# Altium schematic sheet USB.SchDoc: USB interface
size A3; DrawnBy: Mogens Groth Nicolaisen; DocumentNumber: 6; SheetNumber: 6; SheetTotal: 7
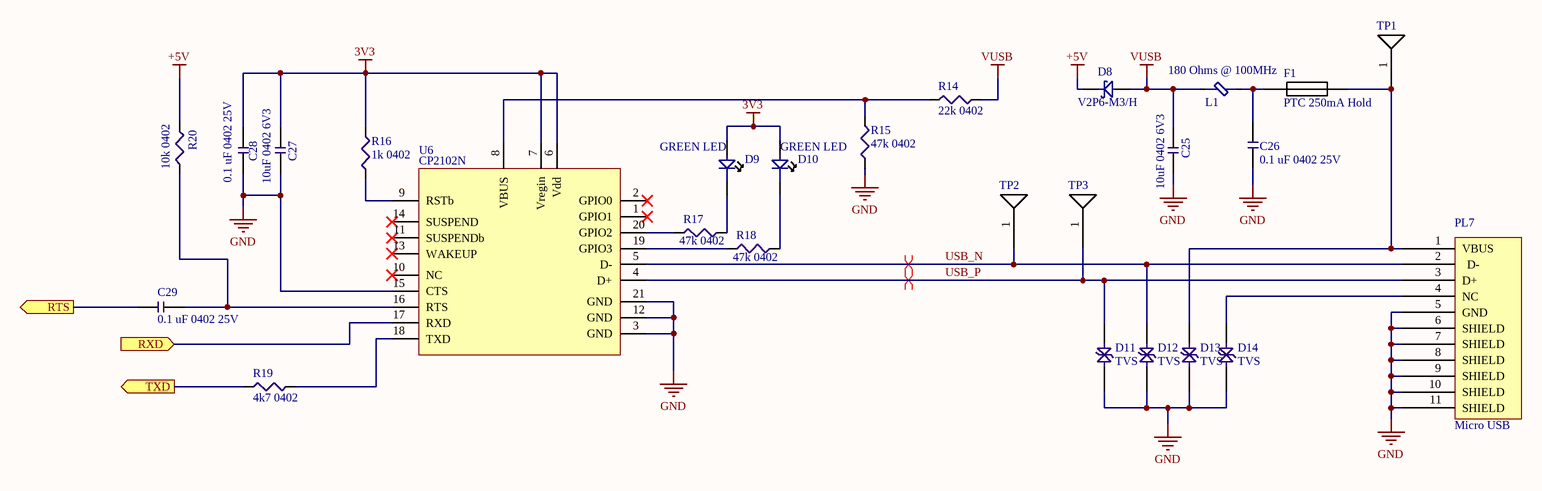
[diagram p0: USB.SchDoc]

## Parts
C25  10uF 0402 6V3  [CAP_0402]
C26  0.1 uF 0402 25V  [CAP_0402]
C27  10uF 0402 6V3  [CAP_0402]
C28  0.1 uF 0402 25V  [CAP_0402]
C29  0.1 uF 0402 25V  [CAP_0402]
D8  V2P6-M3/H  [MicroSMP]
D9  GREEN LED  [0402 LED]
D10  GREEN LED  [0402 LED]
D11  TVS  [RES_0402]
D12  TVS  [RES_0402]
D13  TVS  [RES_0402]
D14  TVS  [RES_0402]
F1  PTC 250mA Hold  [PTC Fuse 1206]
L1  180 Ohms @ 100MHz  [IND_0603]
PL7  Micro USB  [10118193-0001LF Micro USB]
R14  22k 0402  [RES_0402]
R15  47k 0402  [RES_0402]
R16  1k 0402  [RES_0402]
R17  47k 0402  [RES_0402]
R18  47k 0402  [RES_0402]
R19  4k7 0402  [RES_0402]
R20  10k 0402  [RES_0402]
TP1  TestPoint  [1x0mm]  (value not drawn)  (no BOM)
TP2  TestPoint  [1x0mm]  (value not drawn)  (no BOM)
TP3  TestPoint  [1x0mm]  (value not drawn)  (no BOM)
U6  CP2102N  [QFN50P300X300X80_HS-21N]

## Ports
RTS (out), RXD (in), TXD (out)

## Nets
3V3: C27.2 C28.2 D9.1 D10.1 R16.2 U6.6(Vdd) U6.7(Vregin)
+5V: D8.2 R20.2
GND: C25.1 C26.1 C27.1 C28.1 D11.1(Anode) D12.1(Anode) D13.1(Anode) D14.1(Anode) PL7.5(GND) PL7.6(SHIELD) PL7.7(SHIELD) PL7.8(SHIELD) PL7.9(SHIELD) PL7.10(SHIELD) PL7.11(SHIELD) R15.1 U6.3(GND) U6.12(GND) U6.15(CTS) U6.21(GND)
VUSB: C25.2 D8.1 L1.1 R14.2
RTS: C29.2 ; port RTS
RXD: U6.17(RXD) ; port RXD
TXD: R19.2 ; port TXD
USB_N: D12.2(Cathode) PL7.2(D-) TP2.1 U6.5(D-)
USB_P: D11.2(Cathode) PL7.3(D+) TP3.1 U6.4(D+)
NetC26_2: C26.2 F1.1 L1.2
NetC29_1: C29.1 R20.1 U6.16(RTS)
NetD9_2: D9.2 R17.1
NetD10_2: D10.2 R18.1
NetD13_2: D13.2(Cathode) F1.2 PL7.1(VBUS) TP1.1
NetD14_2: D14.2(Cathode) PL7.4(NC)
NetR14_1: R14.1 R15.2 U6.8(VBUS)
NetR16_1: R16.1 U6.9(RSTb)
NetR17_2: R17.2 U6.20(GPIO2)
NetR18_2: R18.2 U6.19(GPIO3)
NetR19_1: R19.1 U6.18(TXD)

Not connected (* = marked no-connect by the designer): U6 1(GPIO1)* 2(GPIO0)* 10(NC)* 11(SUSPENDb)* 13(WAKEUP)* 14(SUSPEND)*

## Layout directives
differential pair: USB_N, USB_P

## Notes on the sheet
- ON Development
- Title:
- Size:
- A3
- Drawn By:
- Date:
- Sheet
- of
- Revision:

## Library data of the parts
C25 C27 = CMP-00011-3: 10uF 20% 0402 6V3 X6S; Current Rating: -; Tolerance: 20%; Value: 10uF; Voltage: 6V3
C26 C28 C29 = CMP-00061-4: 0.1UF 25V 10% X5R 0402; Mfg. Part Number: TMK105BJ104KV-F; Tolerance: 10%; Value: 0.1 uF; Voltage: 25V
D8 = CMP-016-0002-2: DIODE SCHOTTKY 60V 2A MICROSMP
D9 D10 = CMP-008-0001-2: 0402 SMD LED; Mfg. Part Number: LTST-C281KGKT
D11-D14 = CMP-016-0004-2: TVS DIODE 12VC 8A IPP 0402; Mfg. Part Number: GG040205100N2P
F1 = CMP-017-0000-3: PTC RESET FUSE 24V 250MA 1206; Mfg. Part Number: 0ZCJ0025AF2E; Case/Package: 1206; Mount: SMD; Pins: 2; RoHS: Yes
L1 = CMP-ROOT-0005-2: FERRITE BEAD 180 OHM 0603 1LN; Mfg. Part Number: BLM18PG181SN1D; Current: 1.5A; Value: 180 Ohm; Case/Package: 0603
PL7 = CMP-003-0000-3: CONN USB MICRO B RECPT SMT R/A; Mfg. Part Number: 10118193-0001LF
R14 = CMP-001-0026-3: RES SMD 22K OHM 1% 1/16W 0402; Mfg. Part Number: RMCF0402FT22K0; Case/Package: 0402; Power: 1/16W; Tolerance: 1%; Value: 22k
R15 R17 R18 = CMP-001-0027-3: RES SMD 47K OHM 1% 1/16W 0402; Mfg. Part Number: RMCF0402FT47K0; Case/Package: 0402; Power: 1/16W; Tolerance: 1%; Value: 47k
R16 = CMP-001-0025-3: RES SMD 1K OHM 1% 1/16W 0402; Mfg. Part Number: CRG0402F1K0; Case/Package: 0402; Power: 1/16W; Tolerance: 1%; Value: 1k
R19 = CMP-001-0029-3: RES SMD 4.7K OHM 1% 1/16W 0402; Mfg. Part Number: RC1005F472CS; Tolerance: 1; Case/Package: 0402; Power: 1/16W; Value: 4k7
R20 = CMP-001-0019-3: RES SMD 10K OHM 1% 1/16W 0402; Mfg. Part Number: RMCF0402FT10K0; Case/Package: 0402; Power: 1/16 W; Tolerance: 1 %; Value: 10k
TP1-TP3 = CMP-ROOT-0006-0.0
U6 = CMP-00038-5: IC BRIDGE USB TO UART 20QFN; Mfg. Part Number: CP2102N-A01-GQFN20